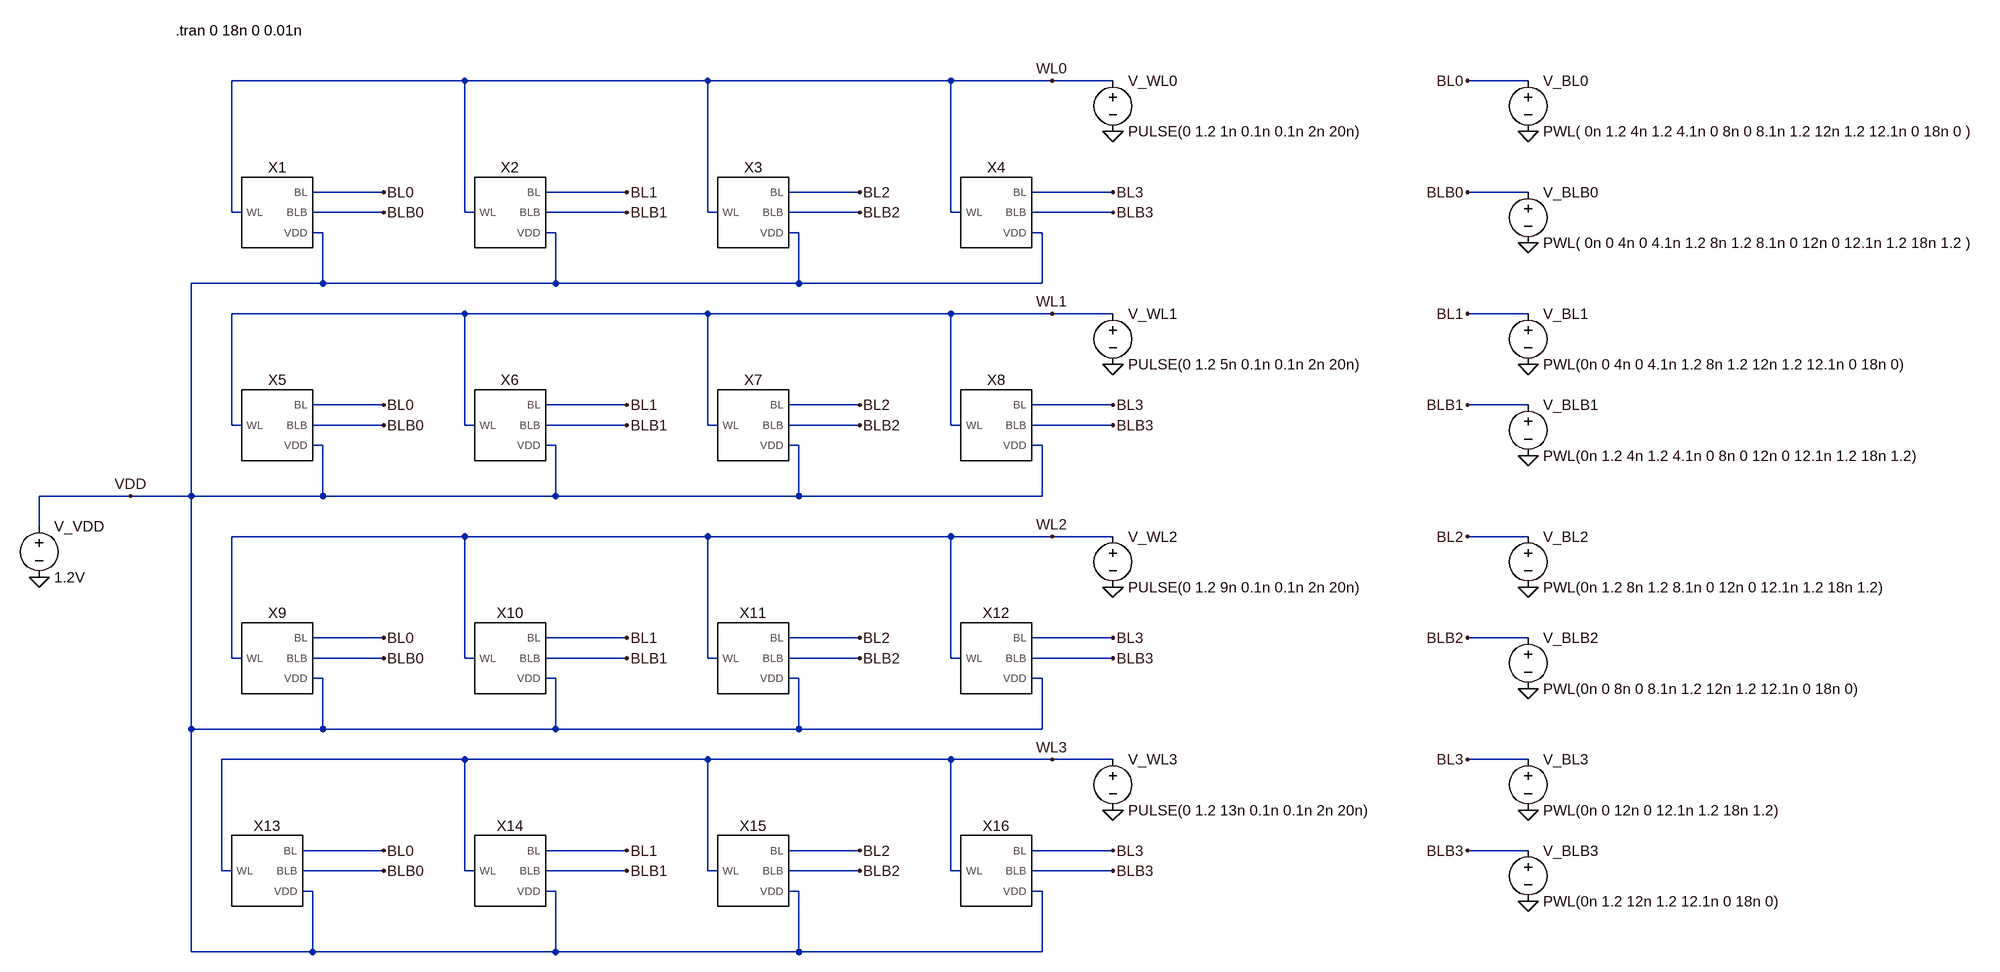
[diagram p0: schematic 4x4_SRAM_ARRAY.asc]
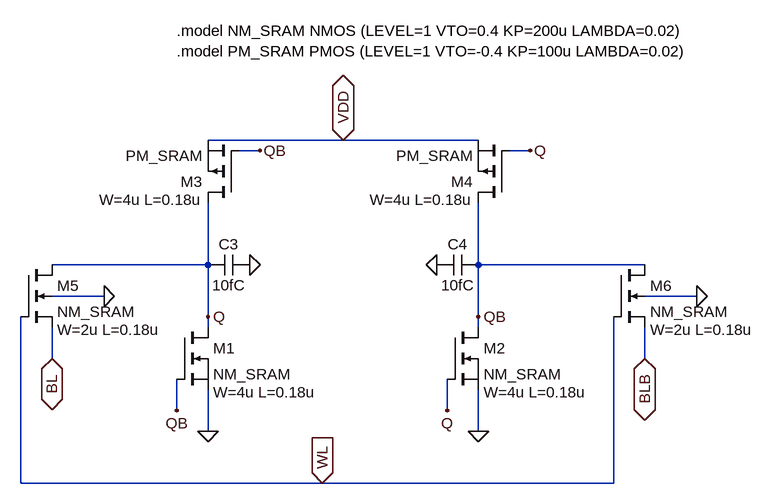
[diagram p1: sub-circuit sram_cell.asc]
4x4_SRAM_ARRAY.asc, the LTspice schematic file:
Version 4.1
SHEET 1 2716 1268
WIRE 272 -128 -96 -128
WIRE 656 -128 272 -128
WIRE 1040 -128 656 -128
WIRE 1200 -128 1040 -128
WIRE 1296 -128 1200 -128
WIRE 1952 -128 1856 -128
WIRE 144 48 32 48
WIRE 528 48 400 48
WIRE 896 48 784 48
WIRE 1296 48 1168 48
WIRE 1952 48 1856 48
WIRE -96 80 -96 -128
WIRE -80 80 -96 80
WIRE 144 80 32 80
WIRE 272 80 272 -128
WIRE 288 80 272 80
WIRE 528 80 400 80
WIRE 656 80 656 -128
WIRE 672 80 656 80
WIRE 896 80 784 80
WIRE 1040 80 1040 -128
WIRE 1056 80 1040 80
WIRE 1296 80 1168 80
WIRE 48 112 32 112
WIRE 416 112 400 112
WIRE 800 112 784 112
WIRE 1184 112 1168 112
WIRE 48 192 48 112
WIRE 48 192 -160 192
WIRE 416 192 416 112
WIRE 416 192 48 192
WIRE 800 192 800 112
WIRE 800 192 416 192
WIRE 1184 192 1184 112
WIRE 1184 192 800 192
WIRE 272 240 -96 240
WIRE 656 240 272 240
WIRE 1040 240 656 240
WIRE 1200 240 1040 240
WIRE 1296 240 1200 240
WIRE 1952 240 1856 240
WIRE 144 384 32 384
WIRE 528 384 400 384
WIRE 896 384 784 384
WIRE 1296 384 1168 384
WIRE 1952 384 1856 384
WIRE -96 416 -96 240
WIRE -80 416 -96 416
WIRE 144 416 32 416
WIRE 272 416 272 240
WIRE 288 416 272 416
WIRE 528 416 400 416
WIRE 656 416 656 240
WIRE 672 416 656 416
WIRE 896 416 784 416
WIRE 1040 416 1040 240
WIRE 1056 416 1040 416
WIRE 1296 416 1168 416
WIRE 48 448 32 448
WIRE 416 448 400 448
WIRE 800 448 784 448
WIRE 1184 448 1168 448
WIRE -256 528 -400 528
WIRE -160 528 -160 192
WIRE -160 528 -256 528
WIRE 48 528 48 448
WIRE 48 528 -160 528
WIRE 416 528 416 448
WIRE 416 528 48 528
WIRE 800 528 800 448
WIRE 800 528 416 528
WIRE 1184 528 1184 448
WIRE 1184 528 800 528
WIRE -400 576 -400 528
WIRE 272 592 -96 592
WIRE 656 592 272 592
WIRE 1040 592 656 592
WIRE 1200 592 1040 592
WIRE 1296 592 1200 592
WIRE 1952 592 1856 592
WIRE 144 752 32 752
WIRE 528 752 400 752
WIRE 896 752 784 752
WIRE 1296 752 1168 752
WIRE 1952 752 1856 752
WIRE -96 784 -96 592
WIRE -80 784 -96 784
WIRE 144 784 32 784
WIRE 272 784 272 592
WIRE 288 784 272 784
WIRE 528 784 400 784
WIRE 656 784 656 592
WIRE 672 784 656 784
WIRE 896 784 784 784
WIRE 1040 784 1040 592
WIRE 1056 784 1040 784
WIRE 1296 784 1168 784
WIRE 48 816 32 816
WIRE 416 816 400 816
WIRE 800 816 784 816
WIRE 1184 816 1168 816
WIRE -160 896 -160 528
WIRE 48 896 48 816
WIRE 48 896 -160 896
WIRE 416 896 416 816
WIRE 416 896 48 896
WIRE 800 896 800 816
WIRE 800 896 416 896
WIRE 1184 896 1184 816
WIRE 1184 896 800 896
WIRE 272 944 -112 944
WIRE 656 944 272 944
WIRE 1040 944 656 944
WIRE 1200 944 1040 944
WIRE 1296 944 1200 944
WIRE 1952 944 1856 944
WIRE 144 1088 16 1088
WIRE 528 1088 400 1088
WIRE 896 1088 784 1088
WIRE 1296 1088 1168 1088
WIRE 1952 1088 1856 1088
WIRE -112 1120 -112 944
WIRE -96 1120 -112 1120
WIRE 144 1120 16 1120
WIRE 272 1120 272 944
WIRE 288 1120 272 1120
WIRE 528 1120 400 1120
WIRE 656 1120 656 944
WIRE 672 1120 656 1120
WIRE 896 1120 784 1120
WIRE 1040 1120 1040 944
WIRE 1056 1120 1040 1120
WIRE 1296 1120 1168 1120
WIRE 32 1152 16 1152
WIRE 416 1152 400 1152
WIRE 800 1152 784 1152
WIRE 1184 1152 1168 1152
WIRE -160 1248 -160 896
WIRE 32 1248 32 1152
WIRE 32 1248 -160 1248
WIRE 416 1248 416 1152
WIRE 416 1248 32 1248
WIRE 800 1248 800 1152
WIRE 800 1248 416 1248
WIRE 1184 1248 1184 1152
WIRE 1184 1248 800 1248
FLAG -256 528 VDD
FLAG 1200 -128 WL0
FLAG 1200 240 WL1
FLAG 1200 592 WL2
FLAG 1200 944 WL3
FLAG 144 48 BL0
FLAG 144 80 BLB0
FLAG 528 80 BLB1
FLAG 528 48 BL1
FLAG 896 48 BL2
FLAG 896 80 BLB2
FLAG 1296 48 BL3
FLAG 1296 80 BLB3
FLAG 1296 384 BL3
FLAG 1296 416 BLB3
FLAG 1296 752 BL3
FLAG 1296 784 BLB3
FLAG 1296 1120 BLB3
FLAG 896 1120 BLB2
FLAG 528 1120 BLB1
FLAG 144 1120 BLB0
FLAG 144 1088 BL0
FLAG 528 1088 BL1
FLAG 896 1088 BL2
FLAG 1296 1088 BL3
FLAG 896 752 BL2
FLAG 896 784 BLB2
FLAG 896 416 BLB2
FLAG 896 384 BL2
FLAG 528 384 BL1
FLAG 528 416 BLB1
FLAG 144 384 BL0
FLAG 144 416 BLB0
FLAG 144 752 BL0
FLAG 144 784 BLB0
FLAG 528 752 BL1
FLAG 528 784 BLB1
FLAG -400 656 0
FLAG 1296 672 0
FLAG 1296 -48 0
FLAG 1296 320 0
FLAG 1296 1024 0
FLAG 1952 128 0
FLAG 1952 -48 0
FLAG 1856 -128 BL0
FLAG 1856 48 BLB0
FLAG 1856 944 BL3
FLAG 1856 1088 BLB3
FLAG 1856 240 BL1
FLAG 1856 384 BLB1
FLAG 1856 592 BL2
FLAG 1856 752 BLB2
FLAG 1952 1168 0
FLAG 1952 1024 0
FLAG 1952 832 0
FLAG 1952 672 0
FLAG 1952 464 0
FLAG 1952 320 0
SYMBOL SRAM_Cell -32 80 R0
SYMATTR InstName X1
SYMBOL SRAM_Cell 336 80 R0
SYMATTR InstName X2
SYMBOL SRAM_Cell 720 80 R0
SYMATTR InstName X3
SYMBOL SRAM_Cell 1104 80 R0
SYMATTR InstName X4
SYMBOL SRAM_Cell -32 416 R0
SYMATTR InstName X5
SYMBOL SRAM_Cell 336 416 R0
SYMATTR InstName X6
SYMBOL SRAM_Cell 720 416 R0
SYMATTR InstName X7
SYMBOL SRAM_Cell 1104 416 R0
SYMATTR InstName X8
SYMBOL SRAM_Cell -32 784 R0
SYMATTR InstName X9
SYMBOL SRAM_Cell 336 784 R0
SYMATTR InstName X10
SYMBOL SRAM_Cell 720 784 R0
SYMATTR InstName X11
SYMBOL SRAM_Cell 1104 784 R0
SYMATTR InstName X12
SYMBOL SRAM_Cell -48 1120 R0
SYMATTR InstName X13
SYMBOL SRAM_Cell 336 1120 R0
SYMATTR InstName X14
SYMBOL SRAM_Cell 720 1120 R0
SYMATTR InstName X15
SYMBOL SRAM_Cell 1104 1120 R0
SYMATTR InstName X16
SYMBOL voltage -400 560 R0
SYMATTR InstName V_VDD
SYMATTR Value 1.2V
SYMBOL voltage 1296 -144 R0
SYMATTR InstName V_WL0
SYMATTR Value PULSE(0 1.2 1n 0.1n 0.1n 2n 20n)
SYMBOL voltage 1296 224 R0
SYMATTR InstName V_WL1
SYMATTR Value PULSE(0 1.2 5n 0.1n 0.1n 2n 20n)
SYMBOL voltage 1296 576 R0
SYMATTR InstName V_WL2
SYMATTR Value PULSE(0 1.2 9n 0.1n 0.1n 2n 20n)
SYMBOL voltage 1296 928 R0
SYMATTR InstName V_WL3
SYMATTR Value PULSE(0 1.2 13n 0.1n 0.1n 2n 20n)
SYMBOL voltage 1952 -144 R0
SYMATTR InstName V_BL0
SYMATTR Value PWL( 0n 1.2 4n 1.2 4.1n 0 8n 0 8.1n 1.2 12n 1.2 12.1n 0 18n 0 )
SYMBOL voltage 1952 32 R0
SYMATTR InstName V_BLB0
SYMATTR Value PWL( 0n 0 4n 0 4.1n 1.2 8n 1.2 8.1n 0 12n 0 12.1n 1.2 18n 1.2 )
SYMBOL voltage 1952 224 R0
SYMATTR InstName V_BL1
SYMATTR Value PWL(0n 0 4n 0 4.1n 1.2 8n 1.2 12n 1.2 12.1n 0 18n 0)
SYMBOL voltage 1952 368 R0
SYMATTR InstName V_BLB1
SYMATTR Value PWL(0n 1.2 4n 1.2 4.1n 0 8n 0 12n 0 12.1n 1.2 18n 1.2)
SYMBOL voltage 1952 576 R0
WINDOW 123 0 0 Left 0
WINDOW 39 0 0 Left 0
SYMATTR InstName V_BL2
SYMATTR Value PWL(0n 1.2 8n 1.2 8.1n 0 12n 0 12.1n 1.2 18n 1.2)
SYMBOL voltage 1952 736 R0
SYMATTR InstName V_BLB2
SYMATTR Value PWL(0n 0 8n 0 8.1n 1.2 12n 1.2 12.1n 0 18n 0)
SYMBOL voltage 1952 928 R0
SYMATTR InstName V_BL3
SYMATTR Value PWL(0n 0 12n 0 12.1n 1.2 18n 1.2)
SYMBOL voltage 1952 1072 R0
SYMATTR InstName V_BLB3
SYMATTR Value PWL(0n 1.2 12n 1.2 12.1n 0 18n 0)
TEXT -184 -208 Left 2 !.tran 0 18n 0 0.01n

sram_cell.asc, the sub-circuit schematic file:
Version 4.1
SHEET 1 3332 820
WIRE 256 -48 48 -48
WIRE 464 -48 256 -48
WIRE 128 -32 96 -32
WIRE 544 -32 512 -32
WIRE 48 144 48 48
WIRE 48 144 -192 144
WIRE 464 144 464 48
WIRE 720 144 464 144
WIRE -112 192 -192 192
WIRE 800 192 720 192
WIRE 48 224 48 144
WIRE 464 224 464 144
WIRE 48 240 48 224
WIRE 464 240 464 224
WIRE -192 288 -192 240
WIRE 720 288 720 240
WIRE 0 368 0 320
WIRE 416 368 416 320
WIRE 48 400 48 336
WIRE 464 400 464 336
WIRE -240 480 -240 224
WIRE 224 480 -240 480
WIRE 672 480 672 224
WIRE 672 480 224 480
FLAG 48 400 0
FLAG 464 400 0
FLAG 48 224 Q
FLAG 464 224 QB
FLAG 224 480 WL
IOPIN 224 480 In
FLAG -192 288 BL
IOPIN -192 288 BiDir
FLAG 720 288 BLB
IOPIN 720 288 BiDir
FLAG 400 144 0
FLAG 112 144 0
FLAG 544 -32 Q
FLAG 128 -32 QB
FLAG 416 368 Q
FLAG 0 368 QB
FLAG 256 -48 VDD
IOPIN 256 -48 BiDir
FLAG 800 192 0
FLAG -112 192 0
SYMBOL nmos 0 240 R0
WINDOW 39 56 100 Left 2
SYMATTR SpiceLine W=4u L=0.18u
SYMATTR InstName M1
SYMATTR Value NM_SRAM
SYMBOL nmos 416 240 R0
WINDOW 39 56 100 Left 2
SYMATTR SpiceLine W=4u L=0.18u
SYMATTR InstName M2
SYMATTR Value NM_SRAM
SYMBOL pmos 96 48 R180
WINDOW 39 56 4 Left 2
SYMATTR SpiceLine W=4u L=0.18u
SYMATTR InstName M3
SYMATTR Value PM_SRAM
SYMBOL pmos 512 48 R180
WINDOW 39 56 4 Left 2
SYMATTR SpiceLine W=4u L=0.18u
SYMATTR InstName M4
SYMATTR Value PM_SRAM
SYMBOL nmos4 -240 144 R0
WINDOW 39 56 100 Left 2
SYMATTR SpiceLine W=2u L=0.18u
SYMATTR InstName M5
SYMATTR Value NM_SRAM
SYMBOL nmos4 672 144 R0
WINDOW 39 56 100 Left 2
SYMATTR SpiceLine W=2u L=0.18u
SYMATTR InstName M6
SYMATTR Value NM_SRAM
SYMBOL cap 112 128 R90
WINDOW 0 0 32 VBottom 2
WINDOW 3 32 32 VTop 2
SYMATTR InstName C3
SYMATTR Value 10fC
SYMBOL cap 464 128 R90
WINDOW 0 0 32 VBottom 2
WINDOW 3 32 32 VTop 2
SYMATTR InstName C4
SYMATTR Value 10fC
TEXT 0 -216 Left 2 !.model NM_SRAM NMOS (LEVEL=1 VTO=0.4 KP=200u LAMBDA=0.02)\n.model PM_SRAM PMOS (LEVEL=1 VTO=-0.4 KP=100u LAMBDA=0.02)

The netlist it stands for:
* 4x4_SRAM_ARRAY.asc
X§X1 WL0 BL0 BLB0 VDD sram_cell
X§X2 WL0 BL1 BLB1 VDD sram_cell
X§X3 WL0 BL2 BLB2 VDD sram_cell
X§X4 WL0 BL3 BLB3 VDD sram_cell
X§X5 WL1 BL0 BLB0 VDD sram_cell
X§X6 WL1 BL1 BLB1 VDD sram_cell
X§X7 WL1 BL2 BLB2 VDD sram_cell
X§X8 WL1 BL3 BLB3 VDD sram_cell
X§X9 WL2 BL0 BLB0 VDD sram_cell
X§X10 WL2 BL1 BLB1 VDD sram_cell
X§X11 WL2 BL2 BLB2 VDD sram_cell
X§X12 WL2 BL3 BLB3 VDD sram_cell
X§X13 WL3 BL0 BLB0 VDD sram_cell
X§X14 WL3 BL1 BLB1 VDD sram_cell
X§X15 WL3 BL2 BLB2 VDD sram_cell
X§X16 WL3 BL3 BLB3 VDD sram_cell
V_VDD VDD 0 1.2V
V_WL0 WL0 0 PULSE(0 1.2 1n 0.1n 0.1n 2n 20n)
V_WL1 WL1 0 PULSE(0 1.2 5n 0.1n 0.1n 2n 20n)
V_WL2 WL2 0 PULSE(0 1.2 9n 0.1n 0.1n 2n 20n)
V_WL3 WL3 0 PULSE(0 1.2 13n 0.1n 0.1n 2n 20n)
V_BL0 BL0 0 PWL( 0n 1.2 4n 1.2 4.1n 0 8n 0 8.1n 1.2 12n 1.2 12.1n 0 18n 0 )
V_BLB0 BLB0 0 PWL( 0n 0 4n 0 4.1n 1.2 8n 1.2 8.1n 0 12n 0 12.1n 1.2 18n 1.2 )
V_BL1 BL1 0 PWL(0n 0 4n 0 4.1n 1.2 8n 1.2 12n 1.2 12.1n 0 18n 0)
V_BLB1 BLB1 0 PWL(0n 1.2 4n 1.2 4.1n 0 8n 0 12n 0 12.1n 1.2 18n 1.2)
V_BL2 BL2 0 PWL(0n 1.2 8n 1.2 8.1n 0 12n 0 12.1n 1.2 18n 1.2)
V_BLB2 BLB2 0 PWL(0n 0 8n 0 8.1n 1.2 12n 1.2 12.1n 0 18n 0)
V_BL3 BL3 0 PWL(0n 0 12n 0 12.1n 1.2 18n 1.2)
V_BLB3 BLB3 0 PWL(0n 1.2 12n 1.2 12.1n 0 18n 0)

* block symbol definitions
.subckt sram_cell WL BL BLB VDD
M1 Q QB 0 0 NM_SRAM W=4u L=0.18u
M2 QB Q 0 0 NM_SRAM W=4u L=0.18u
M3 Q QB VDD VDD PM_SRAM W=4u L=0.18u
M4 QB Q VDD VDD PM_SRAM W=4u L=0.18u
M5 Q WL BL 0 NM_SRAM W=2u L=0.18u
M6 QB WL BLB 0 NM_SRAM W=2u L=0.18u
C3 0 Q 10fC
C4 QB 0 10fC
.model NM_SRAM NMOS (LEVEL=1 VTO=0.4 KP=200u LAMBDA=0.02)
.model PM_SRAM PMOS (LEVEL=1 VTO=-0.4 KP=100u LAMBDA=0.02)
.ends sram_cell

.model NMOS NMOS
.model PMOS PMOS
.lib standard.mos
.tran 0 18n 0 0.01n
.backanno
.end